# Altium schematic sheet STM32.SchDoc
size 508 x 281 mm
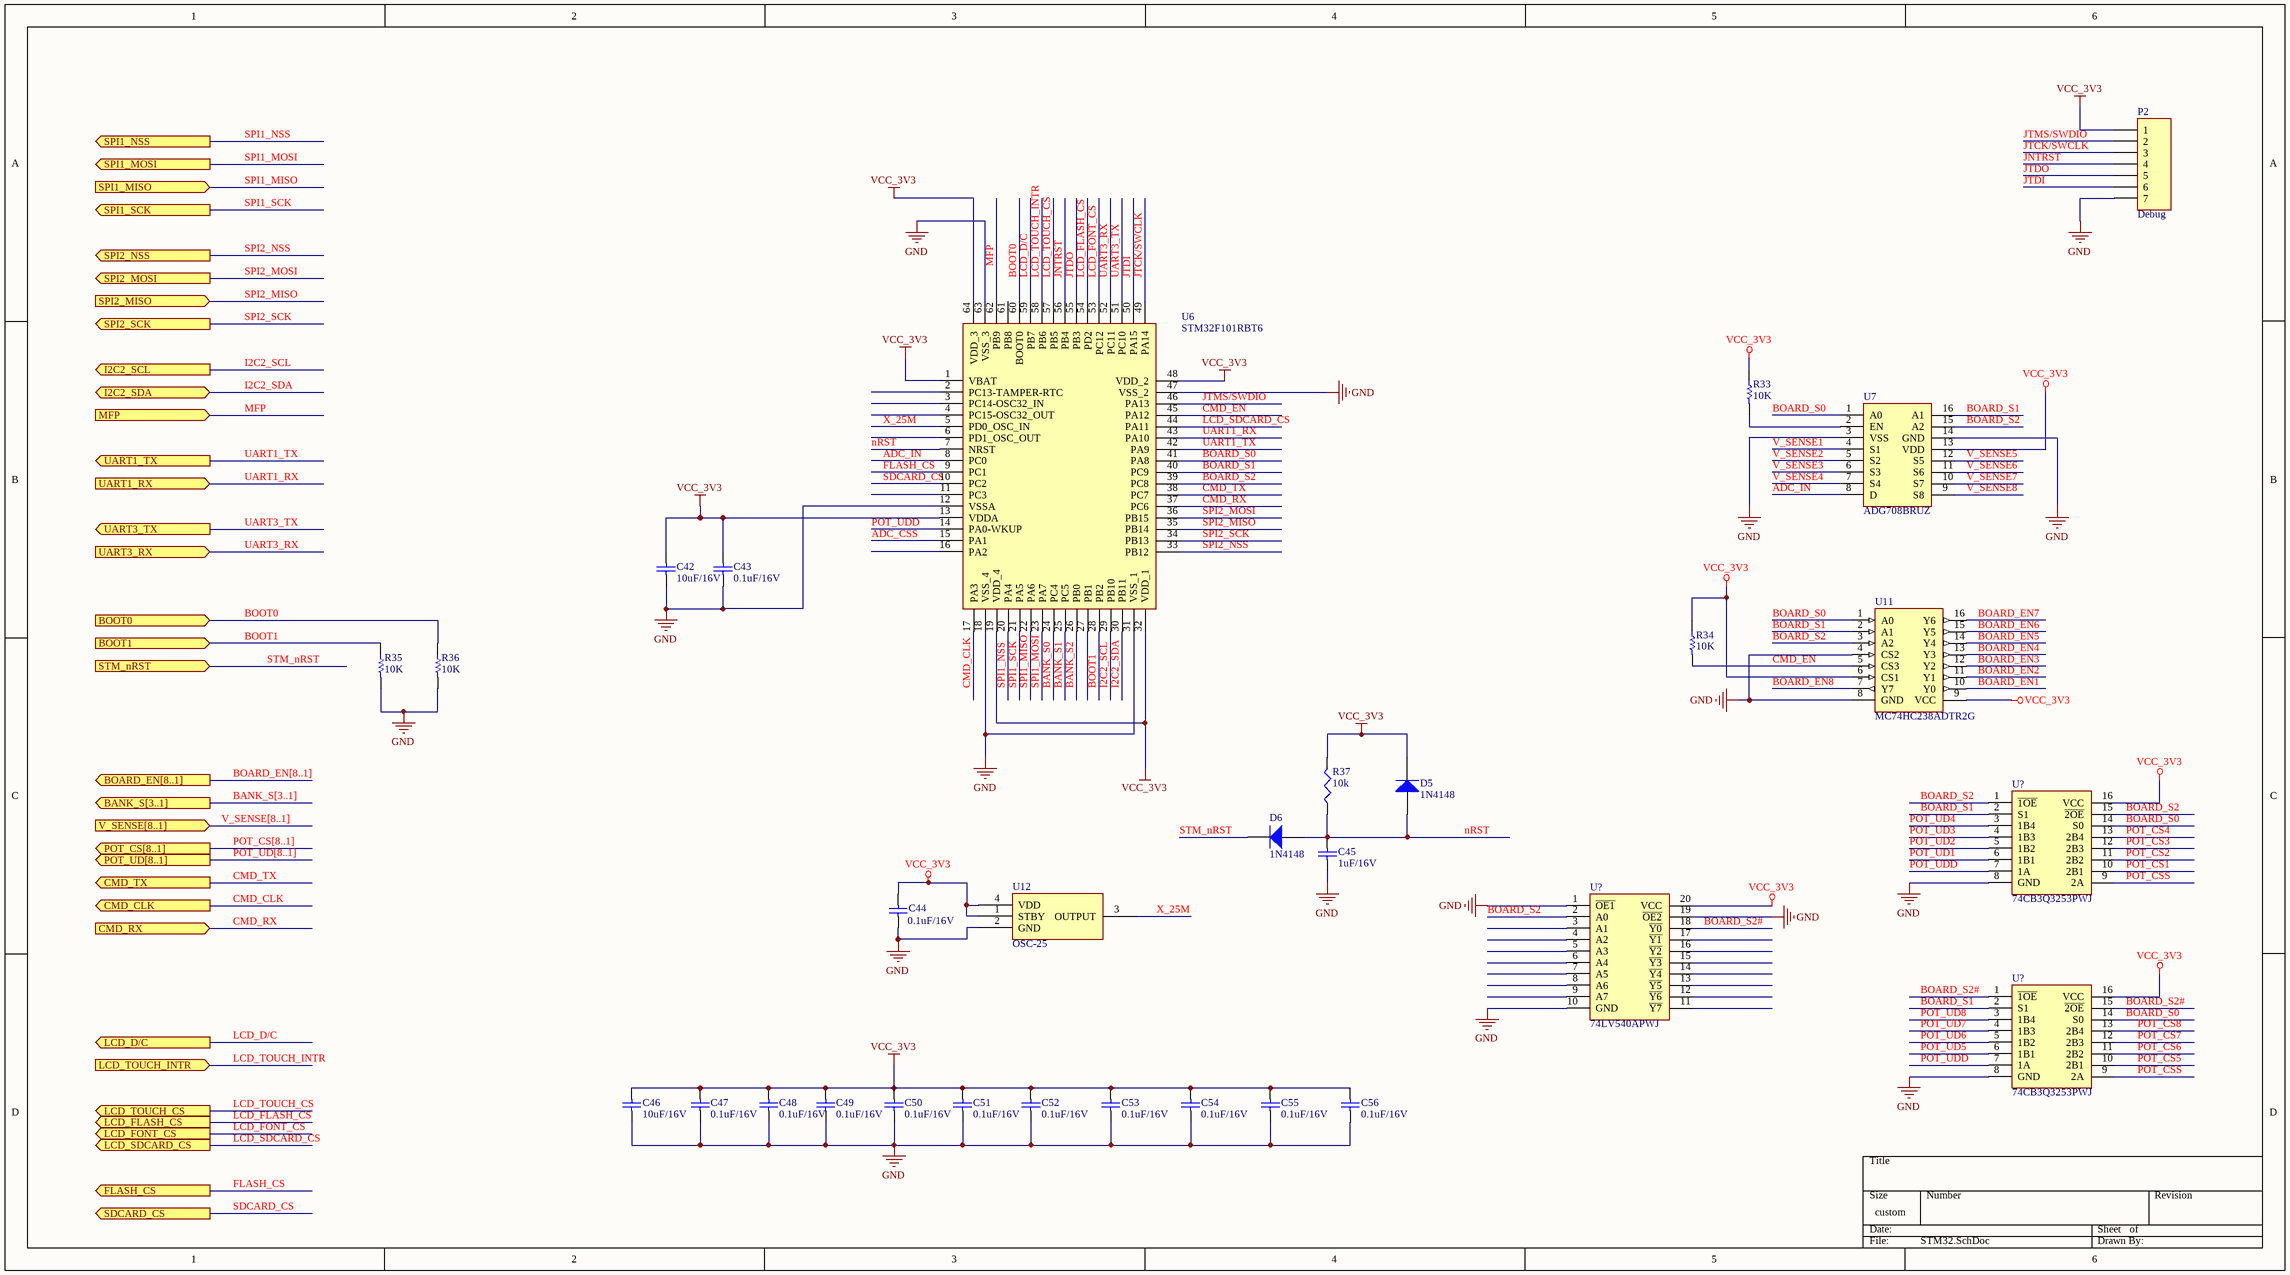
[diagram p0: STM32.SchDoc]

## Parts
(Parts that share a designator on the sheet are numbered #1, #2 ... from top to bottom, then left to right.)
C42  10uF/16V  [RAD-0.3]
C43  0.1uF/16V  [RAD-0.3]
C44  0.1uF/16V  [0402_CAP]
C45  1uF/16V  [RAD-0.3]
C46  10uF/16V  [RAD-0.3]
C47  0.1uF/16V  [RAD-0.3]
C48  0.1uF/16V  [RAD-0.3]
C49  0.1uF/16V  [RAD-0.3]
C50  0.1uF/16V  [RAD-0.3]
C51  0.1uF/16V  [RAD-0.3]
C52  0.1uF/16V  [RAD-0.3]
C53  0.1uF/16V  [RAD-0.3]
C54  0.1uF/16V  [RAD-0.3]
C55  0.1uF/16V  [RAD-0.3]
C56  0.1uF/16V  [RAD-0.3]
D5  1N4148  [1N4148W-13-F]
D6  1N4148  [1N4148W-13-F]
P2  Debug  [HDR1X7]
R33  10K  [AXIAL-0.3]
R34  10K  [AXIAL-0.3]
R35  10K  [AXIAL-0.3]
R36  10K  [AXIAL-0.3]
R37  10k  [0402_RES]
U6  STM32F101RBT6  [QFP50P1200X1200X160-64N]
U7  ADG708BRUZ  [SOP65P640X120-16N]
U11  MC74HC238ADTR2G  [SOP65P640X120-16N]
U12  OSC-25  [ASE-25.000MHZ-LC-T]
U?#1  74CB3Q3253PWJ  [SOP65P640X110-16N]
U?#2  74LV540APWJ  [SOP65P640X110-20N]
U?#3  74CB3Q3253PWJ  [SOP65P640X110-16N]

## Ports
BANK_S[3..1] (out), BOARD_EN[8..1] (out), BOOT0 (in), BOOT1 (in), CMD_CLK (out), CMD_RX (in), CMD_TX (out), FLASH_CS (out), I2C2_SCL (out), I2C2_SDA (bidir), LCD_D/C (out), LCD_FLASH_CS (out), LCD_FONT_CS (out), LCD_SDCARD_CS (out), LCD_TOUCH_CS (out), LCD_TOUCH_INTR (in), MFP (in), POT_CS[8..1] (out), POT_UD[8..1] (out), SDCARD_CS (out), SPI1_MISO (in), SPI1_MOSI (out), SPI1_NSS (out), SPI1_SCK (out), SPI2_MISO (in), SPI2_MOSI (out), SPI2_NSS (out), SPI2_SCK (out), STM_nRST (in), UART1_RX (in), UART1_TX (out), UART3_RX (in), UART3_TX (out), V_SENSE[8..1] (in)

## Nets
GND: C42.2 C43.2 C44.1 C45.2 C46.2 C47.2 C48.2 C49.2 C50.2 C51.2 C52.2 C53.2 C54.2 C55.2 C56.2 P2.7 R35.2 R36.2 U6.12(VSSA) U6.18(VSS_4) U6.31(VSS_1) U6.47(VSS_2) U6.63(VSS_3) U7.3(VSS) U7.14(GND) U11.4(CS2) U11.8(GND) U12.2(GND) U?#1.8(GND) U?#2.1(~{OE1}) U?#2.10(GND) U?#2.19(~{OE2}) U?#3.8(GND)
VCC_3V3: C42.1 C43.1 C44.2 C46.1 C47.1 C48.1 C49.1 C50.1 C51.1 C52.1 C53.1 C54.1 C55.1 C56.1 D5.2(K) P2.1 R33.1 R34.1 R37.2 U6.1(VBAT) U6.13(VDDA) U6.19(VDD_4) U6.32(VDD_1) U6.48(VDD_2) U6.64(VDD_3) U7.13(VDD) U11.6(CS1) U11.9(VCC) U12.1(STBY) U12.4(VDD) U?#1.16(VCC) U?#2.20(VCC) U?#3.16(VCC)
ADC_CSS: U6.15(PA1)
ADC_IN: U6.8(PC0) U7.8(D)
BANK_S0: U6.24(PC4)
BANK_S1: U6.25(PC5)
BANK_S2: U6.26(PB0)
BOARD_EN1: U11.10(Y0)
BOARD_EN2: U11.11(Y1)
BOARD_EN3: U11.12(Y2)
BOARD_EN4: U11.13(Y3)
BOARD_EN5: U11.14(Y4)
BOARD_EN6: U11.15(Y5)
BOARD_EN7: U11.16(Y6)
BOARD_EN8: U11.7(Y7)
BOARD_S0: U6.41(PA8) U7.1(A0) U11.1(A0) U?#1.14(S0) U?#3.14(S0)
BOARD_S1: U6.40(PC9) U7.16(A1) U11.2(A1) U?#1.2(S1) U?#3.2(S1)
BOARD_S2: U6.39(PC8) U7.15(A2) U11.3(A2) U?#1.1(~{1OE}) U?#1.15(~{2OE}) U?#2.2(A0)
BOARD_S2#: U?#2.18(~{Y0}) U?#3.1(~{1OE}) U?#3.15(~{2OE})
BOOT0: R36.1 U6.60(BOOT0) ; port BOOT0
BOOT1: R35.1 U6.28(PB2) ; port BOOT1
CMD_CLK: U6.17(PA3) ; port CMD_CLK
CMD_EN: R34.2 U6.45(PA12) U11.5(CS3)
CMD_RX: U6.37(PC6) ; port CMD_RX
CMD_TX: U6.38(PC7) ; port CMD_TX
FLASH_CS: U6.9(PC1) ; port FLASH_CS
I2C2_SCL: U6.29(PB10) ; port I2C2_SCL
I2C2_SDA: U6.30(PB11) ; port I2C2_SDA
JNTRST: P2.4 U6.56(PB4)
JTCK/SWCLK: P2.3 U6.49(PA14)
JTDI: P2.6 U6.50(PA15)
JTDO: P2.5 U6.55(PB3)
JTMS/SWDIO: P2.2 U6.46(PA13)
LCD_D/C: U6.59(PB7) ; port LCD_D/C
LCD_FLASH_CS: U6.54(PD2) ; port LCD_FLASH_CS
LCD_FONT_CS: U6.53(PC12) ; port LCD_FONT_CS
LCD_SDCARD_CS: U6.44(PA11) ; port LCD_SDCARD_CS
LCD_TOUCH_CS: U6.57(PB5) ; port LCD_TOUCH_CS
LCD_TOUCH_INTR: U6.58(PB6) ; port LCD_TOUCH_INTR
MFP: U6.62(PB9) ; port MFP
nRST: C45.1 D5.1(A) D6.1(A) R37.1 U6.7(NRST)
POT_CS1: U?#1.10(2B1)
POT_CS2: U?#1.11(2B2)
POT_CS3: U?#1.12(2B3)
POT_CS4: U?#1.13(2B4)
POT_CS5: U?#3.10(2B1)
POT_CS6: U?#3.11(2B2)
POT_CS7: U?#3.12(2B3)
POT_CS8: U?#3.13(2B4)
POT_CSS: U?#1.9(2A) U?#3.9(2A)
POT_UD1: U?#1.6(1B1)
POT_UD2: U?#1.5(1B2)
POT_UD3: U?#1.4(1B3)
POT_UD4: U?#1.3(1B4)
POT_UD5: U?#3.6(1B1)
POT_UD6: U?#3.5(1B2)
POT_UD7: U?#3.4(1B3)
POT_UD8: U?#3.3(1B4)
POT_UDD: U6.14(PA0-WKUP) U?#1.7(1A) U?#3.7(1A)
SDCARD_CS: U6.10(PC2) ; port SDCARD_CS
SPI1_MISO: U6.22(PA6) ; port SPI1_MISO
SPI1_MOSI: U6.23(PA7) ; port SPI1_MOSI
SPI1_NSS: U6.20(PA4) ; port SPI1_NSS
SPI1_SCK: U6.21(PA5) ; port SPI1_SCK
SPI2_MISO: U6.35(PB14) ; port SPI2_MISO
SPI2_MOSI: U6.36(PB15) ; port SPI2_MOSI
SPI2_NSS: U6.33(PB12) ; port SPI2_NSS
SPI2_SCK: U6.34(PB13) ; port SPI2_SCK
STM_nRST: D6.2(K) ; port STM_nRST
UART1_RX: U6.43(PA10) ; port UART1_RX
UART1_TX: U6.42(PA9) ; port UART1_TX
UART3_RX: U6.52(PC11) ; port UART3_RX
UART3_TX: U6.51(PC10) ; port UART3_TX
V_SENSE1: U7.4(S1)
V_SENSE2: U7.5(S2)
V_SENSE3: U7.6(S3)
V_SENSE4: U7.7(S4)
V_SENSE5: U7.12(S5)
V_SENSE6: U7.11(S6)
V_SENSE7: U7.10(S7)
V_SENSE8: U7.9(S8)
X_25M: U6.5(PD0_OSC_IN) U12.3(OUTPUT)
NetR33_2: R33.2 U7.2(EN)

Not connected (* = marked no-connect by the designer): U6 2(PC13-TAMPER-RTC) 3(PC14-OSC32_IN) 4(PC15-OSC32_OUT) 6(PD1_OSC_OUT) 11(PC3) 16(PA2) 27(PB1) 61(PB8); U?#2 3(A1) 4(A2) 5(A3) 6(A4) 7(A5) 8(A6) 9(A7) 11(~{Y7}) 12(~{Y6}) 13(~{Y5}) 14(~{Y4}) 15(~{Y3}) 16(~{Y2}) 17(~{Y1})

## Buses and harness runs
bus BANK_S[3..1] = port BANK_S[3..1]
bus BOARD_EN[8..1] = port BOARD_EN[8..1]
bus POT_CS[8..1] = port POT_CS[8..1]
bus POT_UD[8..1] = port POT_UD[8..1]
bus V_SENSE[8..1] = port V_SENSE[8..1]

## Library data of the parts
C42 C43 C45-C56 = Cap: Capacitor; Published: 8-Jun-2000; LatestRevisionDate: 17-Jul-2002; LatestRevisionNote: Re-released for DXP Platform.; PackageReference: RAD-0.3; Publisher: Altium Limited; PackageDescription: Radial Cap, Thru-Hole; 2 Leads; 0.3 in Pin Spacing
  C42 C46: Value: 10uF/16V
  C43 C47-C56: Value: 0.1uF/16V
  C45: Value: 1uF/16V
C44 = Cap: Multilayer Ceramic Capacitors MLCC - SMD/SMT 10% AEC-Q200 16V 0.1uF X7R 0402; Mfr Part No: C0402T104K4RACTU; Manufacturer: KEMET; Value: 0.1uF/16V; Stockiest: MOUSER; Stockiest Part No: 80-C0402T104K4RACTU; Package: 0402; Price: 0.1
D5 D6 = Diode: Diodes - General Purpose, Power, Switching 400mW 100Vrrm 4ns; Value: 100V; Stockiest: MOUSER; Stockiest Part No: 621-1N4148W-13-F; Mfr Part No: 1N4148W-13-F; Package: SOD-123-2; Manufacturer: Diodes
P2 = Header 7: Header, 7-Pin; LatestRevisionDate: 17-Jul-2002; LatestRevisionNote: Re-released for DXP Platform.; Publisher: Altium Limited
R33-R36 = Res1: Resistor; Published: 8-Jun-2000; LatestRevisionDate: 17-Jul-2002; LatestRevisionNote: Re-released for DXP Platform.; PackageReference: AXIAL-0.3; Publisher: Altium Limited; PackageDescription: Axial Device, Thru-Hole; 2 Leads; 0.3 in Pin Spacing; Value: 10K
R37 = 0402_RES: Thick Film Resistors - SMD 10K OHM 1%; Manufacturer: Yageo; Mfr Part No: RC0402FR-0710KL; Package: 0402; Price: 0.1; Stockiest Part No: 603-RC0402FR-0710KL; Value: 10k; Stockiest: MOUSER
U6 = STM32F101RBT6: Integrated Circuit; Manufacturer_Name: STMicroelectronics; Datasheet Link: http://www.st.com/st-web-ui/static/active/en/resource/technical/document/datasheet/CD00161561.pdf; Height: 1.6mm; Manufacturer_Part_Number: STM32F101RBT6; Arrow Part Number: STM32F101RBT6; Arrow Price/Stock: https://www.arrow.com/en/products/stm32f101rbt6/stmicroelectronics; Mouser Part Number: 511-STM32F101RBT6; Mouser Price/Stock: https://www.mouser.co.uk/ProductDetail/STMicroelectronics/STM32F101RBT6?qs=bhCVus9SdFt0EKpQgWIkhA%3D%3D
U7 = ADG708BRUZ: Integrated Circuit; Manufacturer_Name: Analog Devices; Datasheet Link: http://www.analog.com/static/imported-files/data_sheets/ADG708_709.pdf; Height: 1.2mm; Manufacturer_Part_Number: ADG708BRUZ; Arrow Part Number: ADG708BRUZ; Arrow Price/Stock: https://www.arrow.com/en/products/adg708bruz/analog-devices; Mouser Part Number: 584-ADG708BRUZ; Mouser Price/Stock: https://www.mouser.co.uk/ProductDetail/Analog-Devices/ADG708BRUZ?qs=BpaRKvA4VqE6s2wNpzXc6Q%3D%3D
U11 = MC74HC238ADTR2G: Integrated Circuit; Manufacturer_Name: ON Semiconductor; Datasheet Link: https://componentsearchengine.com/Datasheets/2/MC74HC238ADTR2G.pdf; Height: 1.2mm; Manufacturer_Part_Number: MC74HC238ADTR2G; Arrow Part Number: MC74HC238ADTR2G; Arrow Price/Stock: https://www.arrow.com/en/products/mc74hc238adtr2g/on-semiconductor; Mouser Part Number: 863-MC74HC238ADTR2G; Mouser Price/Stock: https://www.mouser.co.uk/ProductDetail/ON-Semiconductor/MC74HC238ADTR2G?qs=mB5q98eOMcYIHVTp70gNug%3D%3D
U12 = CRYSTAL: Standard Clock Oscillators 25.0 MHZ 3.3V 50PPM SMD 32; Manufacturer: Abracon; Value: 25MHZ; Stockiest: MOUSER; Stockiest Part No: 815-ASE25.000MHZLCT; Mfr Part No: ASE-25.000MHZ-LC-T; Package: SMD; Price: 1.5
U?#1 U?#3 = 74CB3Q3253PWJ: Integrated Circuit; Manufacturer_Name: Nexperia; Datasheet Link: https://assets.nexperia.com/documents/data-sheet/74CB3Q3253.pdf; Height: 1.1mm; Manufacturer_Part_Number: 74CB3Q3253PWJ; Arrow Part Number: 74CB3Q3253PWJ; Arrow Price/Stock: https://www.arrow.com/en/products/74cb3q3253pwj/nexperia; Mouser Part Number: 771-74CB3Q3253PWJ; Mouser Price/Stock: https://www.mouser.co.uk/ProductDetail/Nexperia/74CB3Q3253PWJ?qs=YCa%2FAAYMW0039vRtZ2fz%252BA%3D%3D
U?#2 = 74LV540APWJ: Integrated Circuit; Manufacturer_Name: Nexperia; Datasheet Link: https://assets.nexperia.com/documents/data-sheet/74LV540A.pdf; Height: 1.1mm; Manufacturer_Part_Number: 74LV540APWJ; Arrow Part Number: 74LV540APWJ; Arrow Price/Stock: https://www.arrow.com/en/products/74lv540apwj/nexperia; Mouser Part Number: 771-74LV540APWJ; Mouser Price/Stock: https://www.mouser.com/Search/Refine.aspx?Keyword=771-74LV540APWJ